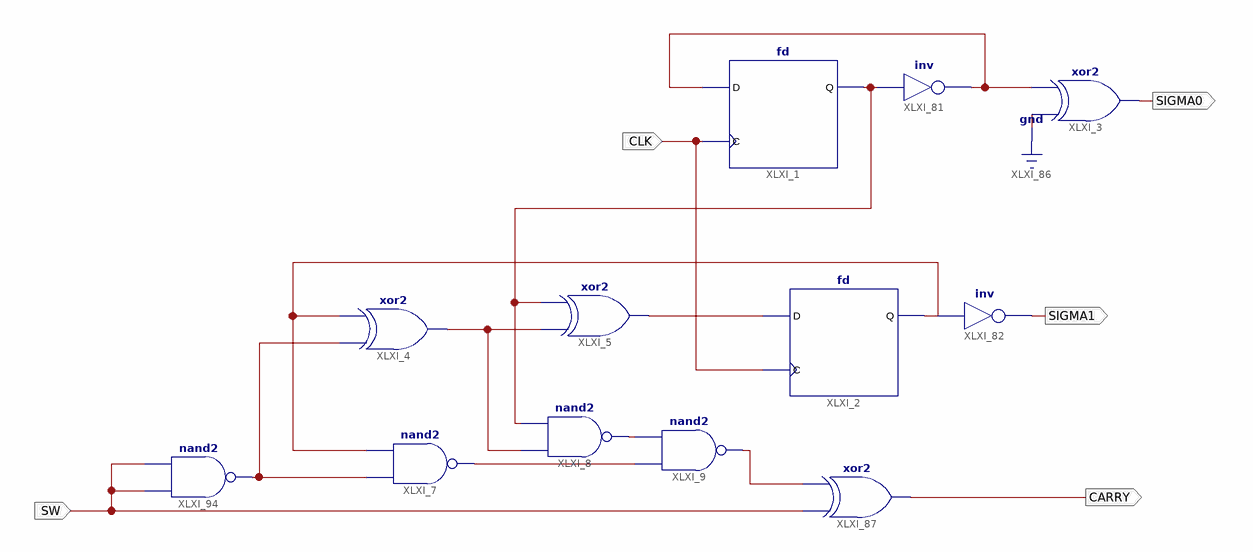
[diagram p0: schematic sheet 1]
// Xilinx ISE schematic UPDOWN_CNT2.sch (spartan6) as structural Verilog: 12 symbols, 5 ports
module UPDOWN_CNT2 (
  input  CLK,
  input  SW,
  output SIGMA1,
  output SIGMA0,
  output CARRY
);

  wire SIGMA0aa, SIGMA1aa, SWaa, XLXN_1, XLXN_21, XLXN_26, XLXN_32, XLXN_103, XLXN_129;

  fd XLXI_1 (.C(CLK), .D(XLXN_129), .Q(SIGMA0aa));
  nand XLXI_7 (XLXN_32, SWaa, SIGMA1aa);
  fd XLXI_2 (.C(CLK), .D(XLXN_26), .Q(SIGMA1aa));
  xor XLXI_5 (XLXN_26, XLXN_21, SIGMA0aa);
  nand XLXI_8 (XLXN_1, XLXN_21, SIGMA0aa);
  nand XLXI_9 (XLXN_103, XLXN_32, XLXN_1);
  not XLXI_82 (SIGMA1, SIGMA1aa);
  xor XLXI_3 (SIGMA0, 1'b0, XLXN_129);
  not XLXI_81 (XLXN_129, SIGMA0aa);
  xor XLXI_87 (CARRY, SW, XLXN_103);
  nand XLXI_94 (SWaa, SW, SW);
  xor XLXI_4 (XLXN_21, SWaa, SIGMA1aa);
endmodule
